# EAGLE design hpmon_pi_baseboard (EAGLE 9.6.2)
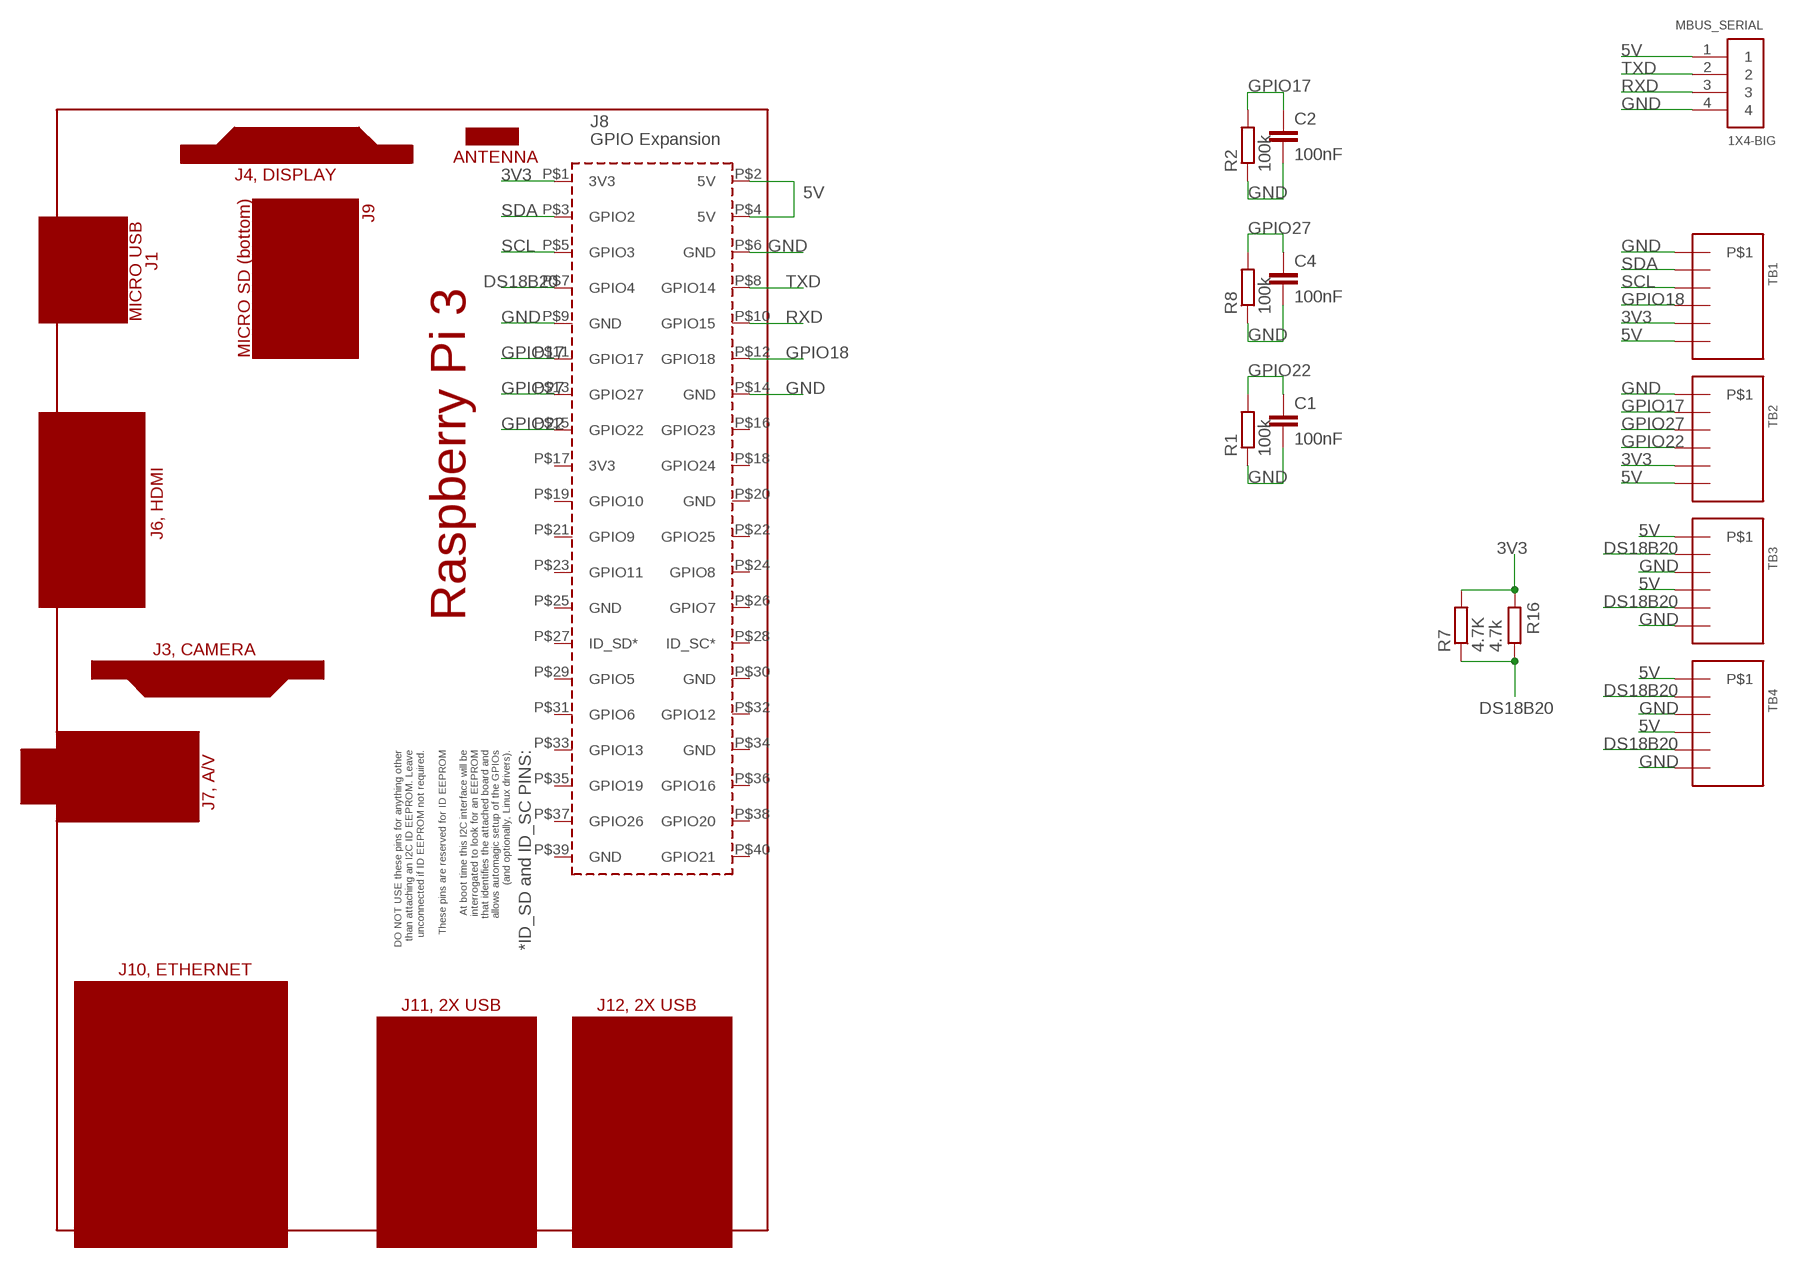
[diagram p0: schematic, sheet 1]

## Parts
C1  100nF  C-EU025-024X044  [C025-024X044]
C2  100nF  C-EU025-024X044  [C025-024X044]
C4  100nF  C-EU025-024X044  [C025-024X044]
MBUS_SERIAL  1X4-BIG  [1X04-BIG]
PCB1  RPI3RPI3  [RPI3]
R1  100k  R-EU_0207/2V  [0207/2V]
R2  100k  R-EU_0207/2V  [0207/2V]
R7  4.7K  R-EU_0204/7  [0204/7]
R8  100k  R-EU_0207/2V  [0207/2V]
R16  4.7k  R-EU_R0603  [R0603]
TB1  3.5MM_TB_X6  [3.5MM_X6]
TB2  3.5MM_TB_X6  [3.5MM_X6]
TB3  3.5MM_TB_X6  [3.5MM_X6]
TB4  3.5MM_TB_X6  [3.5MM_X6]

## Nets
3V3: PCB1.P$1(3V3) R7.2 R16.2 TB1.P$5 TB2.P$5
5V: MBUS_SERIAL.1 PCB1.P$2(5V) PCB1.P$4(5V) TB1.P$6 TB2.P$6 TB3.P$1 TB3.P$4 TB4.P$1 TB4.P$4
DS18B20: PCB1.P$7(GPIO4) R7.1 R16.1 TB3.P$2 TB3.P$5 TB4.P$2 TB4.P$5
GND [power]: C1.2 C2.2 C4.2 MBUS_SERIAL.4 PCB1.P$6(GND) PCB1.P$9(GND) PCB1.P$14(GND) R1.1 R2.1 R8.1 TB1.P$1 TB2.P$1 TB3.P$3 TB3.P$6 TB4.P$3 TB4.P$6
GPIO17: C2.1 PCB1.P$11(GPIO17) R2.2 TB2.P$2
GPIO18: PCB1.P$12(GPIO18) TB1.P$4
GPIO22: C1.1 PCB1.P$15(GPIO22) R1.2 TB2.P$4
GPIO27: C4.1 PCB1.P$13(GPIO27) R8.2 TB2.P$3
RXD: MBUS_SERIAL.3 PCB1.P$10(GPIO15)
SCL: PCB1.P$5(GPIO3) TB1.P$3
SDA: PCB1.P$3(GPIO2) TB1.P$2
TXD: MBUS_SERIAL.2 PCB1.P$8(GPIO14)
Unconnected: PCB1.P$16(GPIO23) PCB1.P$17(3V3) PCB1.P$18(GPIO24) PCB1.P$19(GPIO10) PCB1.P$20(GND) PCB1.P$21(GPIO9) PCB1.P$22(GPIO25) PCB1.P$23(GPIO11) PCB1.P$24(GPIO8) PCB1.P$25(GND) PCB1.P$26(GPIO7) PCB1.P$27(ID_SD*) PCB1.P$28(ID_SC*) PCB1.P$29(GPIO5) PCB1.P$30(GND) PCB1.P$31(GPIO6) PCB1.P$32(GPIO12) PCB1.P$33(GPIO13) PCB1.P$34(GND) PCB1.P$35(GPIO19) PCB1.P$36(GPIO16) PCB1.P$37(GPIO26) PCB1.P$38(GPIO20) PCB1.P$39(GND) PCB1.P$40(GPIO21)

## Library data of the parts
C1 C2 C4 = resistor:C-EU: CAPACITOR, European symbol
MBUS_SERIAL = adafruit:1X4: 4-pin connector
PCB1 = e14_Rpi3_RevA+mirror-pcb:RPI3: Device for Raspberry Pi 3 board created by Dave Young for www.element14.com More information and support community is available at https://www.element14.com/community/community/raspberry-pi Device for Raspberry Pi 3 board updated by Gerald Schwarz for www.element14.com On RPI3 addet the layer milling and created a mirrored shield.
R1 R2 R8 R16 = rcl:R-EU_: RESISTOR, European symbol
R7 = resistor:R-EU_: RESISTOR, European symbol
TB1-TB4 = 3.5mm terminal block rs pro:3.5MM_TB_X6

## Net classes
0 default: width 0.203 mm, drill 0.6 mm, clearance 0.203 mm
1 power: width 0.381 mm, drill 0.6 mm, clearance 0.254 mm
2 gnd: width 0.254 mm, drill 0.5 mm, clearance 0.152 mm

## Board
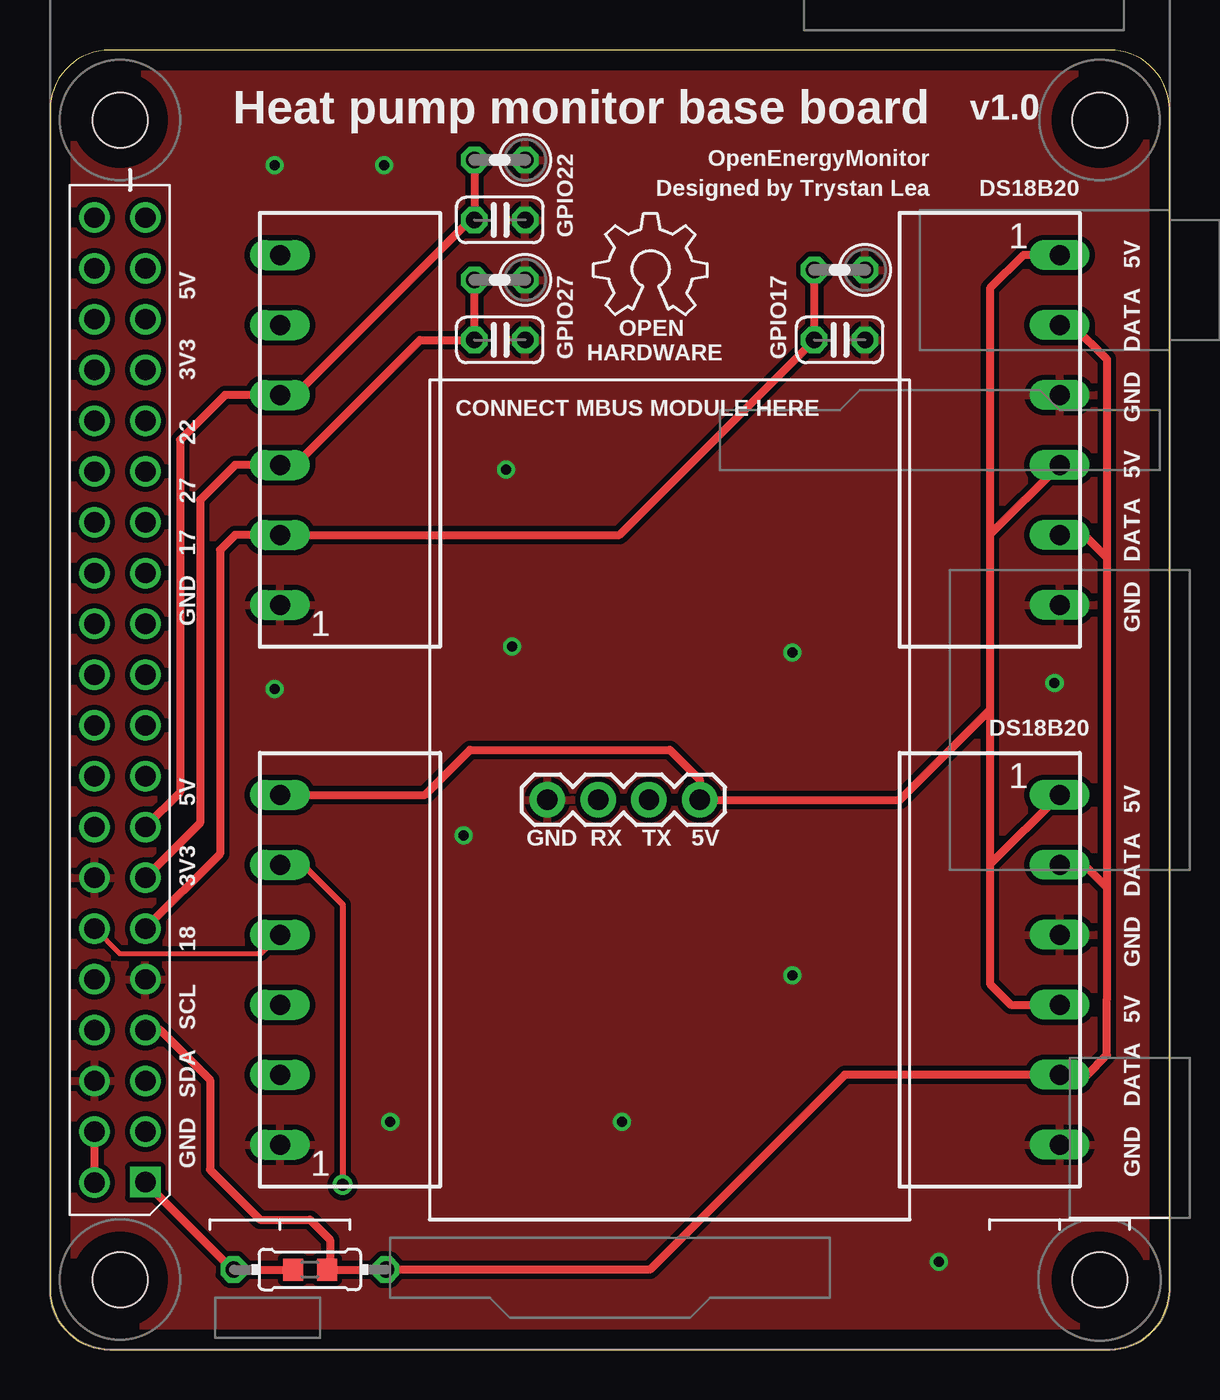
[diagram p1: board, top side]
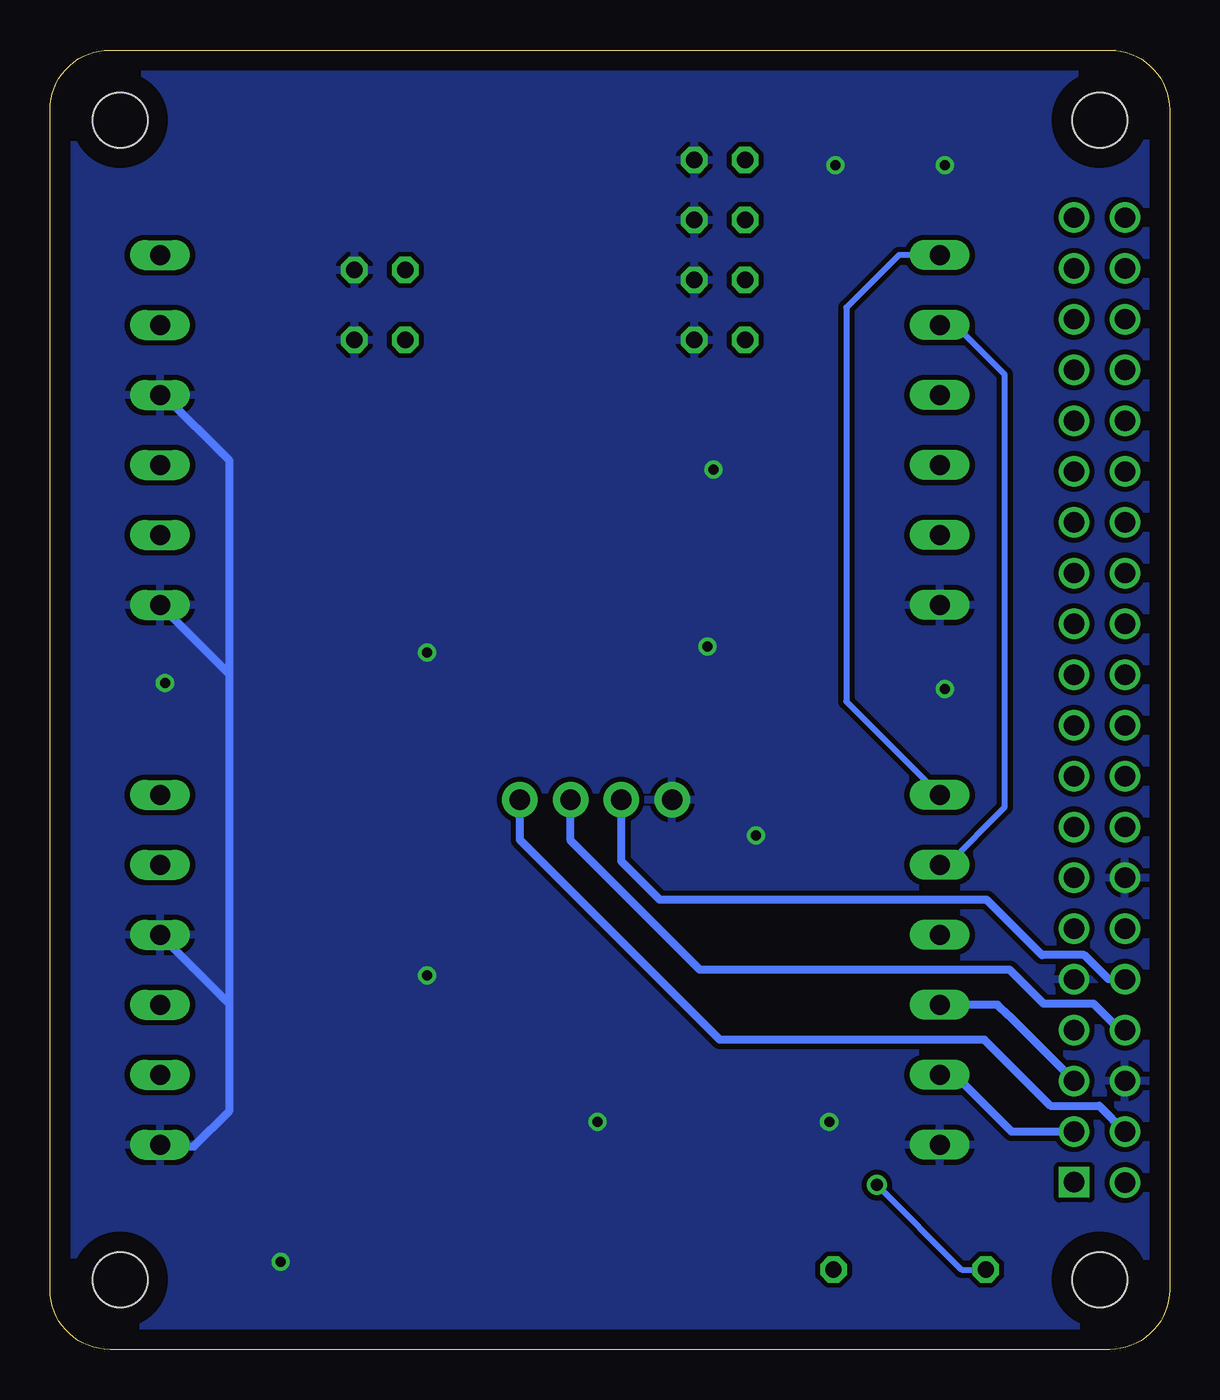
[diagram p2: board, bottom side, seen from below]

Size 56 x 65 mm. Coordinates in mm from the lower left corner, seen from the top.
Outline: 0,62 0,3 arc90 3,0 53,0 arc90 56,3 56,62 arc90 53,65 3,65 arc90 0,62
Copper layers (1*16): Top 0.035mm / dielectric 1.5mm / Bottom 0.035mm
Design rules "default *": minimum track width 6mil, minimum drill 0.35mm, track to track 6mil, track to pad 6mil, pad to pad 6mil, via to via 6mil, smd to smd 6mil, copper to edge 40mil, drill to drill 6mil, minimum pad ring 10mil, minimum via ring 8mil, stop-mask expansion 4mil, vias tented up to drill 0.6mm, thermal gap 10mil

### Footprints (pad centres in the part's own frame; a part is rotated, then mirrored left to right if it is on the bottom)
C025-024X044 = drill 0.813 octagon: 1 -1.27,0; 2 1.27,0
1X04-BIG = drill 1.016 pad 1.778: 1 0,0; 2 2.54,0; 3 5.08,0; 4 7.62,0
RPI3 = drill 1.016 square: P$1 8.37,51.23 | drill 1.016: P$2 8.357,53.772; P$3 10.897,51.232; P$4 10.897,53.772; P$5 13.437,51.232; P$6 13.437,53.772; P$7 15.977,51.232; P$8 15.977,53.772; P$9 18.517,51.232; P$10 18.517,53.772; P$11 21.057,51.232; P$12 21.057,53.772; P$13 23.597,51.232; P$14 23.597,53.772; P$15 26.137,51.232; P$16 26.137,53.772; P$17 28.677,51.232; P$18 28.677,53.772; P$19 31.217,51.232; P$20 31.217,53.772; P$21 33.757,51.232; P$22 33.757,53.772; P$23 36.297,51.232; P$24 36.297,53.772; P$25 38.837,51.232; P$26 38.837,53.772; P$27 41.377,51.232; P$28 41.377,53.772; P$29 43.917,51.232; P$30 43.917,53.772; P$31 46.457,51.232; P$32 46.457,53.772; P$33 48.997,51.232; P$34 48.997,53.772; P$35 51.537,51.232; P$36 51.537,53.772; P$37 54.077,51.232; P$38 54.077,53.772; P$39 56.617,51.232; P$40 56.617,53.772 | hole 2.75: 3.5,3.5; 61.5,3.5; 3.5,52.5; 61.5,52.5
0207/2V = drill 0.813 octagon: 1 -1.27,0; 2 1.27,0
0204/7 = drill 0.813 octagon: 1 -3.81,0; 2 3.81,0
R0603 = smd 1 x 1.1: 1 -0.85,0; 2 0.85,0
3.5MM_X6 = drill 1 long: P$1 3,8.75; P$2 3,5.25; P$3 3,1.75; P$4 3,-1.75; P$5 3,-5.25; P$6 3,-8.75

### Placement (x,y rotation side)
C1  22.5,56.5 0 top
C2  39.5,50.5 0 top
C4  22.5,50.5 0 top
LOGO2  OSHW_LOGO_6MILX0200-NT  [OSHW_6X200_NOTEXT]  27.2,51.75 0 top
MBUS_SERIAL  32.5,27.5 180 top
PCB1  56,0 90 top
R1  22.5,59.5 180 top
R2  39.5,54 180 top
R7  13,4 180 top
R8  22.5,53.5 180 top
R16  13,4 180 top
TB1  14.5,19 180 top
TB2  14.5,46 180 top
TB3  47.5,19 0 top
TB4  47.5,46 0 top

### Tracks (layer width: path | path; a pad name or v marks a point on that pad's centre or on a via)
3V3  (via drill 0.6)
  Top 0.305: TB1.P$5 12.37,24.25 12.51,24.38 14.64,22.25 14.64,11.64 v14.64,8.23
  Top 0.406: R16.2 R7.2 9.14,4 PCB1.P$1
  Bottom 0.305: TB1.P$5 11.12,24.25 8.24,27.13 8.24,48.77 10.72,51.25 TB2.P$5 | v14.64,8.23 10.41,4 R7.2
5V
  Top 0.406: TB4.P$1 48.69,54.75 47.02,53.09 47.02,40.77 | TB3.P$4 48.06,17.25 47.02,18.29 47.02,24.27 | 47.02,40.77 47.02,32 | 47.02,32 47.02,24.27 | PCB1.P$2 PCB1.P$4 | TB4.P$4 47.02,40.77 | TB3.P$1 47.02,24.27 | 47.02,32 42.52,27.5 MBUS_SERIAL.1 32.5,28.5 31,30 21,30 18.75,27.75 TB1.P$6
  Bottom 0.305: TB2.P$6 13.54,54.75 16.16,52.12 16.16,32.41 TB1.P$6
  Bottom 0.406: MBUS_SERIAL.1 32.5,25.5 22.5,15.5 9.26,15.5 5.95,12.19 3.52,12.19 PCB1.P$4
DS18B20
  Top 0.406: TB4.P$2 51.15,51.25 52.87,49.53 52.87,39.62 | 52.87,39.62 52.87,23.11 | 52.87,23.11 52.87,17.53 52.87,14.73 51.85,13.72 51.82,13.75 TB3.P$5 39.75,13.75 30,4 R7.1 14,4 | TB4.P$5 51.74,40.75 52.87,39.62 | TB3.P$2 51.73,24.25 52.87,23.11 | R16.1 14,4 | PCB1.P$7 5.48,15.98 5.5,16 8,13.5 8,9 10.5,6.5 13,6.5 14,5.5 14,4
GND  (via drill 0.5)
  Bottom 0.406: TB4.P$3 50.32,47.75 47.02,44.45 47.02,33.77 | 47.02,17.27 47.02,11.94 48.8,10.16 50.41,10.16 TB3.P$6 51.54,10.25 | 47.02,17.27 47.02,33.77 | TB4.P$6 47.02,33.77 | TB3.P$3 47.02,17.27
  other vias: 17.02,11.39 23.12,35.16 37.14,34.86 37.14,18.71 28.61,11.39 50.25,33.34 22.82,44 11.23,59.24 16.72,59.24 20.68,25.72 11.23,33.03 44.46,4.38
  pour Top: -0.5,66 -0.5,-0.5 57.5,-0.5 57.5,66
  pour Bottom: -1,-1 57.5,-1 57.5,66.5 -1,66.5
GPIO17
  Top 0.406: PCB1.P$11 8.5,24.79 8.5,40 9.25,40.75 TB2.P$2 28.48,40.75 C2.1 R2.2
GPIO18
  Top 0.254: PCB1.P$12 3.47,19.81 10.56,19.81 TB1.P$4
GPIO22
  Top 0.406: PCB1.P$15 6.5,27.87 6.5,45.5 8.75,47.75 TB2.P$4 12.25,47.75 21,56.5 | 21,56.5 C1.1 | R1.2 21.23,56.73 21,56.5
GPIO27
  Top 0.406: 4.79,23.62 PCB1.P$13 7.5,26.33 7.5,42.5 9.25,44.25 TB2.P$3 12.25,44.25 18.5,50.5 C4.1 R8.2
RXD
  Bottom 0.406: PCB1.P$10 3.04,18.52 4.26,19.74 6.39,19.74 9.15,22.5 25.5,22.5 25.75,22.75 27.42,24.42 MBUS_SERIAL.3
SCL
  Bottom 0.406: PCB1.P$5 8.02,16.69 8.05,16.69 8.61,17.25 TB1.P$3
SDA
  Bottom 0.406: PCB1.P$3 7.9,10.9 10.75,13.75 TB1.P$2
TXD
  Bottom 0.406: PCB1.P$8 2.48,15.98 3.8,17.3 6.3,17.3 8,19 23.5,19 29.96,25.46 MBUS_SERIAL.2

### Text on the board
tNames: Heat pump monitor base board | v1.0 | GPIO22 | OpenEnergyMonitor | Designed by Trystan Lea | DS18B20 | GND DATA 5V | GPIO27 | GPIO17 | OPEN / HARDWARE | CONNECT MBUS MODULE HERE | GND DATA 5V | GND 17 27 22 3V3 5V | DS18B20 | GND DATA 5V | GND RX TX 5V | GND DATA 5V | GND SDA SCL 18 3V3 5V